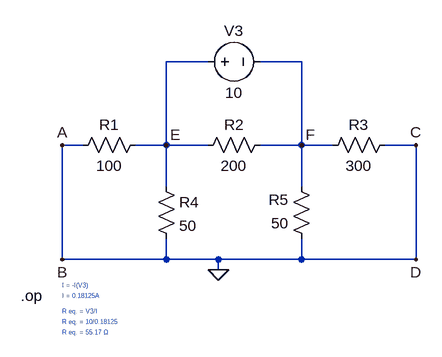
[diagram p0: schematic Eq_R_part3.asc]
Eq_R_part3.asc, the LTspice schematic file:
Version 4
SHEET 1 880 680
WIRE 320 -96 256 -96
WIRE 464 -96 400 -96
WIRE 128 32 96 32
WIRE 256 32 256 -96
WIRE 256 32 208 32
WIRE 320 32 256 32
WIRE 464 32 464 -96
WIRE 464 32 400 32
WIRE 512 32 464 32
WIRE 640 32 592 32
WIRE 256 96 256 32
WIRE 464 96 464 32
WIRE 96 208 96 32
WIRE 256 208 256 176
WIRE 256 208 96 208
WIRE 336 208 256 208
WIRE 464 208 464 176
WIRE 464 208 336 208
WIRE 640 208 640 32
WIRE 640 208 464 208
WIRE 336 224 336 208
FLAG 336 224 0
FLAG 96 32 A
FLAG 96 208 B
FLAG 640 32 C
FLAG 640 208 D
FLAG 256 32 E
FLAG 464 32 F
SYMBOL res 224 16 R90
WINDOW 0 0 56 VBottom 2
WINDOW 3 32 56 VTop 2
SYMATTR InstName R1
SYMATTR Value 100
SYMBOL res 304 48 R270
WINDOW 0 32 56 VTop 2
WINDOW 3 0 56 VBottom 2
SYMATTR InstName R2
SYMATTR Value 200
SYMBOL res 608 16 R90
WINDOW 0 0 56 VBottom 2
WINDOW 3 32 56 VTop 2
SYMATTR InstName R3
SYMATTR Value 300
SYMBOL res 240 80 R0
SYMATTR InstName R4
SYMATTR Value 50
SYMBOL res 480 192 R180
WINDOW 0 36 76 Left 2
WINDOW 3 36 40 Left 2
SYMATTR InstName R5
SYMATTR Value 50
SYMBOL voltage 304 -96 R270
WINDOW 0 32 56 VTop 2
WINDOW 3 -32 56 VBottom 2
SYMATTR InstName V3
SYMATTR Value 10
TEXT 32 264 Left 2 !.op
TEXT 96 248 Left 0 ;I = -I(V3)
TEXT 96 264 Left 0 ;I = 0.18125A
TEXT 96 288 Left 0 ;R eq. = V3/I
TEXT 96 304 Left 0 ;R eq. = 10/0.18125
TEXT 96 320 Left 0 ;R eq. = 55.17 Ω

The netlist it stands for:
* Eq_R_part3.asc
R1 E 0 100
R2 E F 200
R3 0 F 300
R4 E 0 50
R5 0 F 50
V3 E F 10
.op
* I = -I(V3)
* I = 0.18125A
* R eq. = V3/I
* R eq. = 10/0.18125
* R eq. = 55.17 Ω
.backanno
.end

* Results of the author's LTspice run, read from the files saved beside the schematic
* Operating Point:
*   V(e) = 4.375 V
*   V(f) = -5.625 V
*   I(R5) = 112.5 mA
*   I(R4) = 87.5 mA
*   I(R3) = 18.75 mA
*   I(R2) = 50 mA
*   I(R1) = 43.75 mA
*   I(V3) = -181.3 mA